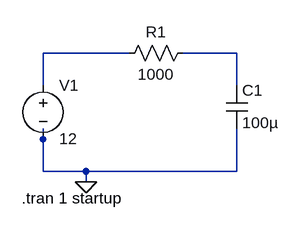
[diagram p0: schematic Draft3w 2.asc]
Draft3w 2.asc, the LTspice schematic file:
Version 4.1
SHEET 1 880 680
WIRE 96 80 -32 80
WIRE 256 80 176 80
WIRE -32 128 -32 80
WIRE 256 128 256 80
WIRE -32 208 -32 192
WIRE -32 256 -32 208
WIRE 32 256 -32 256
WIRE 256 256 256 192
WIRE 256 256 32 256
WIRE 32 272 32 256
FLAG 32 272 0
SYMBOL voltage -32 112 R0
WINDOW 123 0 0 Left 0
WINDOW 39 0 0 Left 0
SYMATTR InstName V1
SYMATTR Value 12
SYMBOL res 192 64 R90
WINDOW 0 0 56 VBottom 2
WINDOW 3 32 56 VTop 2
SYMATTR InstName R1
SYMATTR Value 1000
SYMBOL cap 240 128 R0
SYMATTR InstName C1
SYMATTR Value 100µ
TEXT -64 296 Left 2 !.tran 1 startup

The netlist it stands for:
* Draft3w 2.asc
V1 N001 0 12
R1 N002 N001 1000
C1 N002 0 100µ
.tran 1 startup
.backanno
.end